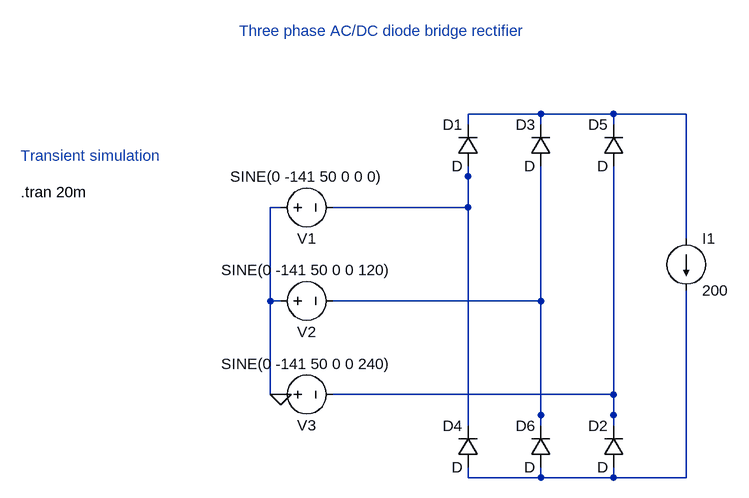
[diagram p0: schematic Three-phase-rectifier.asc]
Three-phase-rectifier.asc, the LTspice schematic file:
Version 4.1
SHEET 1 932 680
WIRE -176 96 -192 96
WIRE -176 240 -192 240
WIRE -176 384 -192 384
WIRE -192 96 -192 240
WIRE -192 240 -192 384
FLAG -176 384 0
WIRE 112 -32 112 -48
WIRE 224 -32 224 -48
WIRE 336 -32 336 -48
WIRE 448 144 448 128
WIRE 112 -48 224 -48
WIRE 224 -48 336 -48
WIRE 336 -48 448 -48
WIRE 448 -48 448 128
WIRE 112 32 112 48
WIRE 112 432 112 416
WIRE -96 96 -80 96
WIRE 112 48 112 96
WIRE 112 96 -80 96
WIRE 112 48 112 416
WIRE 224 32 224 48
WIRE 224 432 224 416
WIRE -96 240 -80 240
WIRE 224 48 224 416
WIRE 224 416 224 240
WIRE 224 240 -80 240
WIRE 336 432 336 416
WIRE 336 32 336 48
WIRE -96 384 -80 384
WIRE 336 416 336 48
WIRE 336 416 336 384
WIRE 336 384 -80 384
WIRE 336 496 336 512
WIRE 112 496 112 512
WIRE 224 496 224 512
WIRE 448 224 448 240
WIRE 336 512 224 512
WIRE 224 512 112 512
WIRE 336 512 448 512
WIRE 448 512 448 240
SYMBOL voltage -192 96 R270
WINDOW 0 -32 56 VBottom 2
WINDOW 3 32 56 VTop 2
WINDOW 123 0 0 Left 0
WINDOW 39 0 0 Left 0
SYMATTR InstName V1
SYMATTR Value SINE(0 -141 50 0 0 0)
SYMBOL voltage -192 240 R270
WINDOW 0 -32 56 VBottom 2
WINDOW 3 32 56 VTop 2
WINDOW 123 0 0 Left 0
WINDOW 39 0 0 Left 0
SYMATTR InstName V2
SYMATTR Value SINE(0 -141 50 0 0 120)
SYMBOL voltage -192 384 R270
WINDOW 0 -32 56 VBottom 2
WINDOW 3 32 56 VTop 2
WINDOW 123 0 0 Left 0
WINDOW 39 0 0 Left 0
SYMATTR InstName V3
SYMATTR Value SINE(0 -141 50 0 0 240)
SYMBOL diode 128 32 R180
WINDOW 0 24 64 Left 2
WINDOW 3 24 0 Left 2
SYMATTR InstName D1
SYMBOL diode 352 496 R180
WINDOW 0 24 64 Left 2
WINDOW 3 24 0 Left 2
SYMATTR InstName D2
SYMBOL diode 240 32 R180
WINDOW 0 24 64 Left 2
WINDOW 3 24 0 Left 2
SYMATTR InstName D3
SYMBOL diode 128 496 R180
WINDOW 0 24 64 Left 2
WINDOW 3 24 0 Left 2
SYMATTR InstName D4
SYMBOL diode 352 32 R180
WINDOW 0 24 64 Left 2
WINDOW 3 24 0 Left 2
SYMATTR InstName D5
SYMBOL diode 240 496 R180
WINDOW 0 24 64 Left 2
WINDOW 3 24 0 Left 2
SYMATTR InstName D6
SYMBOL current 448 144 R0
WINDOW 123 0 0 Left 0
WINDOW 39 0 0 Left 0
SYMATTR InstName I1
SYMATTR Value 200
TEXT -576 72 Left 2 !.tran 20m
TEXT -240 -176 Left 2 ;Three phase AC/DC diode bridge rectifier
TEXT -576 16 Left 2 ;Transient simulation

The netlist it stands for:
* Three-phase-rectifier.asc
V1 0 N002 SINE(0 -141 50 0 0 0)
V2 0 N003 SINE(0 -141 50 0 0 120)
V3 0 N004 SINE(0 -141 50 0 0 240)
D1 N002 N001 D
D2 N005 N004 D
D3 N003 N001 D
D4 N005 N002 D
D5 N004 N001 D
D6 N005 N003 D
I1 N001 N005 200
.model D D
.lib standard.dio
.tran 20m
* Three phase AC/DC diode bridge rectifier
* Transient simulation
.backanno
.end